# Altium schematic sheet AHK50H-ND_THERM_CONNECTOR.SchDoc
size A; DocumentNumber: 1; SheetNumber: 1; SheetTotal: 5
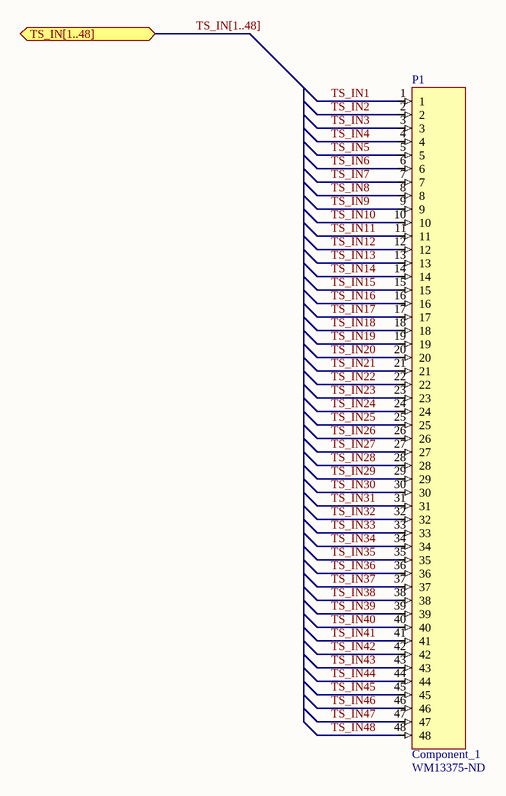
[diagram p0: AHK50H-ND_THERM_CONNECTOR.SchDoc]

## Parts
P1  Component_1  Supplier Part Number 1: WM13375-ND  [Molex CMC 36638]

## Ports
TS_IN[1..48] (bidir)

## Nets
TS_IN1: P1.1
TS_IN2: P1.2
TS_IN3: P1.3
TS_IN4: P1.4
TS_IN5: P1.5
TS_IN6: P1.6
TS_IN7: P1.7
TS_IN8: P1.8
TS_IN9: P1.9
TS_IN10: P1.10
TS_IN11: P1.11
TS_IN12: P1.12
TS_IN13: P1.13
TS_IN14: P1.14
TS_IN15: P1.15
TS_IN16: P1.16
TS_IN17: P1.17
TS_IN18: P1.18
TS_IN19: P1.19
TS_IN20: P1.20
TS_IN21: P1.21
TS_IN22: P1.22
TS_IN23: P1.23
TS_IN24: P1.24
TS_IN25: P1.25
TS_IN26: P1.26
TS_IN27: P1.27
TS_IN28: P1.28
TS_IN29: P1.29
TS_IN30: P1.30
TS_IN31: P1.31
TS_IN32: P1.32
TS_IN33: P1.33
TS_IN34: P1.34
TS_IN35: P1.35
TS_IN36: P1.36
TS_IN37: P1.37
TS_IN38: P1.38
TS_IN39: P1.39
TS_IN40: P1.40
TS_IN41: P1.41
TS_IN42: P1.42
TS_IN43: P1.43
TS_IN44: P1.44
TS_IN45: P1.45
TS_IN46: P1.46
TS_IN47: P1.47
TS_IN48: P1.48

## Buses and harness runs
bus TS_IN[1..48] = port TS_IN[1..48]

## Library data of the parts
P1 = Component_1: CONN CMC HEADER 48POS R/A BROWN; Supplier 1: Digi-Key